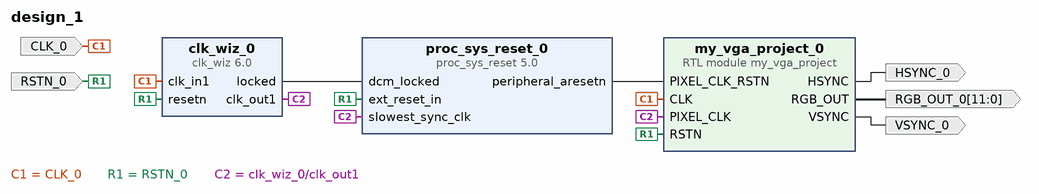
[diagram p0: block diagram of the top level]
# Vivado block design design_1, xc7z010clg400-1, Vivado 2024.2
create_bd_design design_1

create_bd_port -dir I -type clk CLK_0
set_property -dict {CONFIG.FREQ_HZ 125000000} [get_bd_ports CLK_0]
create_bd_port -dir I -type rst RSTN_0
create_bd_port -dir O HSYNC_0
create_bd_port -dir O VSYNC_0
create_bd_port -dir O -from 11 -to 0 RGB_OUT_0

create_bd_cell -type module -reference my_vga_project my_vga_project_0
create_bd_cell -type ip -vlnv xilinx.com:ip:clk_wiz:6.0 clk_wiz_0
set_property -dict [list \
  CONFIG.CLKIN1_JITTER_PS 80.0 \
  CONFIG.CLKOUT1_JITTER 281.423 \
  CONFIG.CLKOUT1_PHASE_ERROR 365.405 \
  CONFIG.CLKOUT1_REQUESTED_OUT_FREQ 25.175 \
  CONFIG.MMCM_CLKFBOUT_MULT_F 61.500 \
  CONFIG.MMCM_CLKIN1_PERIOD 8.000 \
  CONFIG.MMCM_CLKOUT0_DIVIDE_F 43.625 \
  CONFIG.MMCM_DIVCLK_DIVIDE 7 \
  CONFIG.PRIM_IN_FREQ 125.000 \
  CONFIG.RESET_PORT resetn \
  CONFIG.RESET_TYPE ACTIVE_LOW \
] [get_bd_cells clk_wiz_0]
create_bd_cell -type ip -vlnv xilinx.com:ip:proc_sys_reset:5.0 proc_sys_reset_0

# ---- connections ----

connect_bd_net -net CLK_0_1 [get_bd_ports CLK_0] [get_bd_pins clk_wiz_0/clk_in1] [get_bd_pins my_vga_project_0/CLK]
connect_bd_net -net RSTN_0_1 [get_bd_ports RSTN_0] \
  [get_bd_pins clk_wiz_0/resetn] [get_bd_pins proc_sys_reset_0/ext_reset_in] [get_bd_pins my_vga_project_0/RSTN]
connect_bd_net [get_bd_pins clk_wiz_0/clk_out1] [get_bd_pins proc_sys_reset_0/slowest_sync_clk] [get_bd_pins my_vga_project_0/PIXEL_CLK]
connect_bd_net [get_bd_pins clk_wiz_0/locked] [get_bd_pins proc_sys_reset_0/dcm_locked]
connect_bd_net [get_bd_pins my_vga_project_0/HSYNC] [get_bd_ports HSYNC_0]
connect_bd_net [get_bd_pins my_vga_project_0/RGB_OUT] [get_bd_ports RGB_OUT_0]
connect_bd_net [get_bd_pins my_vga_project_0/VSYNC] [get_bd_ports VSYNC_0]
connect_bd_net [get_bd_pins proc_sys_reset_0/peripheral_aresetn] [get_bd_pins my_vga_project_0/PIXEL_CLK_RSTN]

validate_bd_design
save_bd_design
